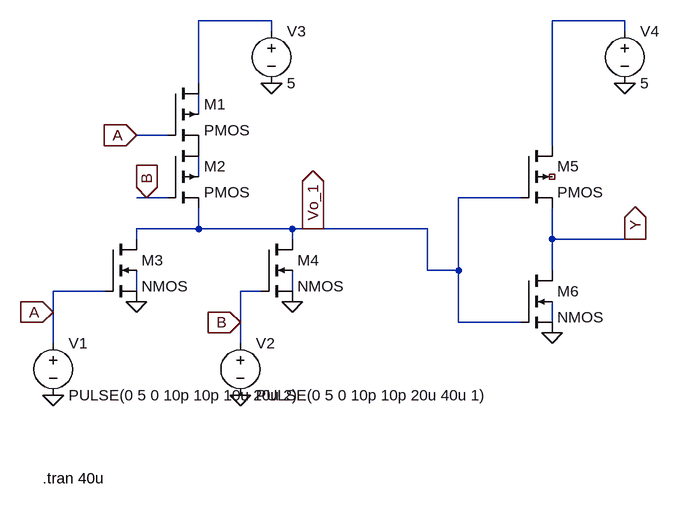
[diagram p0: schematic A1_1RV21EC116_PavanKumarCBanasode.asc]
A1_1RV21EC116_PavanKumarCBanasode.asc, the LTspice schematic file:
Version 4
SHEET 1 1096 704
WIRE 480 -16 368 -16
WIRE 1024 -16 912 -16
WIRE 480 0 480 -16
WIRE 1024 0 1024 -16
WIRE 368 80 368 -16
WIRE 368 128 368 96
WIRE 320 160 272 160
WIRE 912 176 912 -16
WIRE 368 224 368 192
WIRE 288 256 272 256
WIRE 320 256 288 256
WIRE 864 256 768 256
WIRE 368 304 368 272
WIRE 368 304 272 304
WIRE 512 304 368 304
WIRE 544 304 512 304
WIRE 720 304 544 304
WIRE 272 320 272 304
WIRE 512 320 512 304
WIRE 912 320 912 272
WIRE 1040 320 912 320
WIRE 1056 320 1040 320
WIRE 720 368 720 304
WIRE 768 368 768 256
WIRE 768 368 720 368
WIRE 912 368 912 320
WIRE 224 400 144 400
WIRE 272 400 272 368
WIRE 464 400 432 400
WIRE 512 400 512 368
WIRE 144 432 144 400
WIRE 432 448 432 400
WIRE 768 448 768 368
WIRE 864 448 768 448
WIRE 912 448 912 416
WIRE 144 480 144 432
WIRE 432 480 432 448
FLAG 272 416 0
FLAG 512 416 0
FLAG 480 80 0
FLAG 144 560 0
FLAG 432 560 0
FLAG 144 432 A
IOPIN 144 432 In
FLAG 432 448 B
IOPIN 432 448 In
FLAG 272 160 A
IOPIN 272 160 In
FLAG 288 256 B
IOPIN 288 256 In
FLAG 544 304 Vo_1
IOPIN 544 304 Out
FLAG 912 464 0
FLAG 1024 80 0
FLAG 1040 320 Y
IOPIN 1040 320 Out
SYMBOL pmos4 320 80 R0
SYMATTR InstName M1
SYMBOL pmos4 320 176 R0
SYMATTR InstName M2
SYMBOL nmos4 224 320 R0
SYMATTR InstName M3
SYMBOL nmos4 464 320 R0
SYMATTR InstName M4
SYMBOL Voltage 144 464 R0
SYMATTR InstName V1
SYMATTR Value PULSE(0 5 0 10p 10p 10u 20u 2)
SYMBOL Voltage 432 464 R0
SYMATTR InstName V2
SYMATTR Value PULSE(0 5 0 10p 10p 20u 40u 1)
SYMBOL Voltage 480 -16 R0
SYMATTR InstName V3
SYMATTR Value 5
SYMBOL nmos4 864 368 R0
SYMATTR InstName M6
SYMBOL pmos4 864 176 R0
SYMATTR InstName M5
SYMBOL Voltage 1024 -16 R0
SYMATTR InstName V4
SYMATTR Value 5
TEXT 128 688 Left 2 !.tran 40u

The netlist it stands for:
* A1_1RV21EC116_PavanKumarCBanasode.asc
M1 N001 A P001 N003 PMOS
M2 P001 B Vo_1 N004 PMOS
M3 Vo_1 A 0 N005 NMOS
M4 Vo_1 B 0 N006 NMOS
V1 A 0 PULSE(0 5 0 10p 10p 10u 20u 2)
V2 B 0 PULSE(0 5 0 10p 10p 20u 40u 1)
V3 N001 0 5
M6 Y Vo_1 0 N007 NMOS
M5 N002 Vo_1 Y NC_01 PMOS
V4 N002 0 5
.model NMOS NMOS
.model PMOS PMOS
.lib standard.mos
.tran 40u
.backanno
.end